# EAGLE design rekuperator THT (EAGLE 6.5.0)
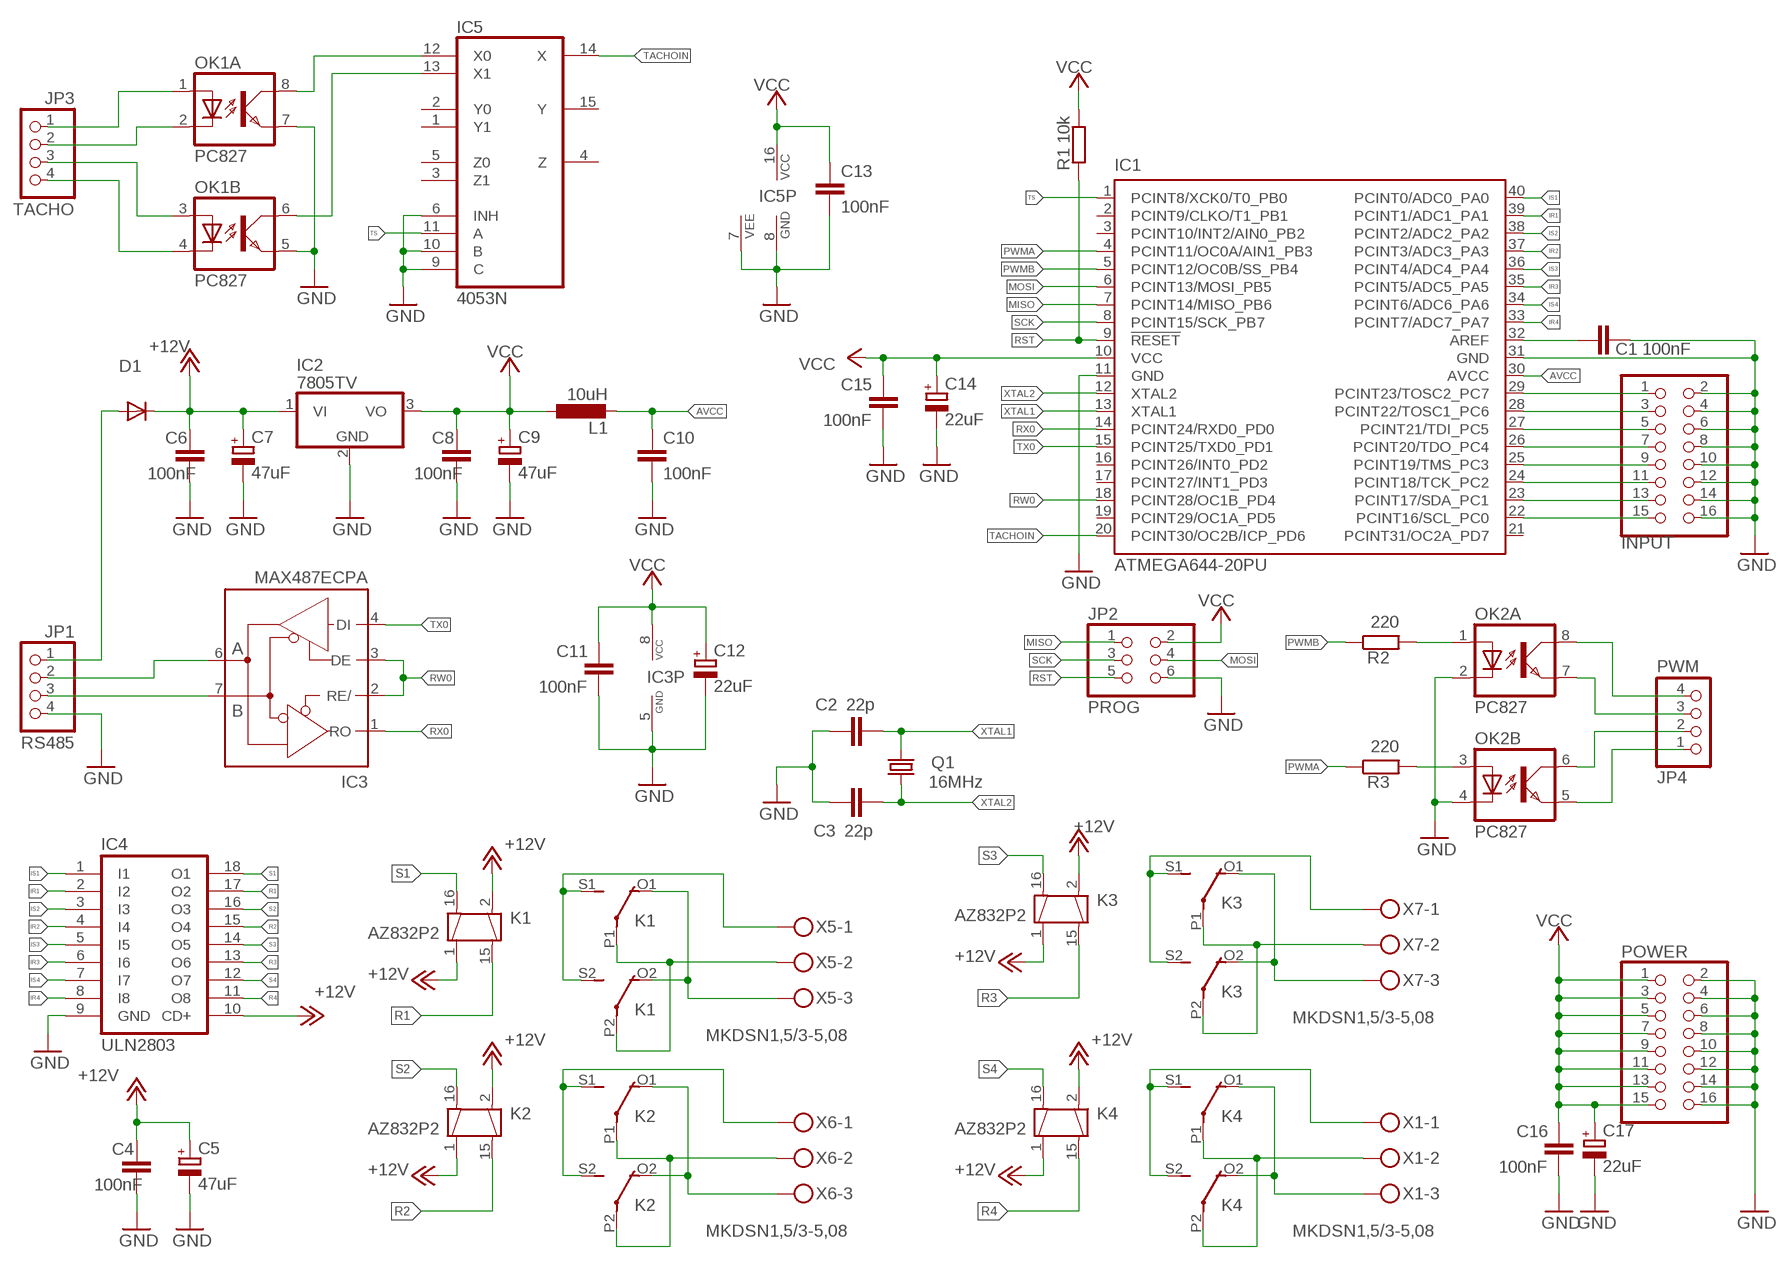
[diagram p0: schematic, sheet 1]

## Parts
C1  100nF  C-EU025-025X050  [C025-025X050]
C2  22p  C-EU025-024X044  [C025-024X044]
C3  22p  C-EU025-024X044  [C025-024X044]
C4  100nF  C-EU025-025X050  [C025-025X050]
C5  47uF  CPOL-EUE2.5-6  [E2,5-6]
C6  100nF  C-EU025-025X050  [C025-025X050]
C7  47uF  CPOL-EUE2.5-6  [E2,5-6]
C8  100nF  C-EU025-025X050  [C025-025X050]
C9  47uF  CPOL-EUE2.5-6  [E2,5-6]
C10  100nF  C-EU025-025X050  [C025-025X050]
C11  100nF  C-EU025-025X050  [C025-025X050]
C12  22uF  CPOL-EUE2-5  [E2-5]
C13  100nF  C-EU025-025X050  [C025-025X050]
C14  22uF  CPOL-EUE2-5  [E2-5]
C15  100nF  C-EU025-025X050  [C025-025X050]
C16  100nF  C-EU025-025X050  [C025-025X050]
C17  22uF  CPOL-EUE2-5  [E2-5]
D1  1N4002  BAS15  [DO34-7]
IC1  ATMEGA644-20PU  [DIL40]
IC2  7805TV  [TO220V]
IC3  MAX487ECPA  MAX481CPA  [DIL08]
IC4  ULN2803  ULN2803A  [DIL18]
IC5  4053N  [DIL16]
INPUT  PINHD-2X8  [2X08]
JP1  RS485  PINHD-1X4  [1X04]
JP2  PROG  PINHD-2X3  [2X03]
JP3  TACHO  PINHD-1X4  [1X04]
JP4  PWM  PINHD-1X4  [1X04]
K1  AZ832P2  DS2-L2-24V  [DS2E-L2]
K2  AZ832P2  DS2-L2-24V  [DS2E-L2]
K3  AZ832P2  DS2-L2-24V  [DS2E-L2]
K4  AZ832P2  DS2-L2-24V  [DS2E-L2]
L1  10uH  L-EU0207/12  [0207/12]
OK1  PC827  [DIL08]
OK2  PC827  [DIL08]
POWER  PINHD-2X8  [2X08]
Q1  16MHz  CRYSTALHC49S  [HC49/S]
R1  10k  R-EU_0204/2V  [0204V]
R2  220  R-EU_0207/12  [0207/12]
R3  220  R-EU_0207/12  [0207/12]
X1  MKDSN1,5/3-5,08  [MKDSN1,5/3-5,08]
X5  MKDSN1,5/3-5,08  [MKDSN1,5/3-5,08]
X6  MKDSN1,5/3-5,08  [MKDSN1,5/3-5,08]
X7  MKDSN1,5/3-5,08  [MKDSN1,5/3-5,08]

## Nets
+12V: C4.1 C5.+ C6.1 C7.+ D1.C IC2.1(VI) IC4.10(CD+) K1.1 K1.2 K2.1 K2.2 K3.1 K3.2 K4.1 K4.2
AVCC: C10.1 IC1.30(AVCC) L1.2
GND: C1.2 C2.1 C3.1 C4.2 C5.- C6.2 C7.- C8.2 C9.- C10.2 C11.2 C12.- C13.2 C14.- C15.2 C16.2 C17.- IC1.11(GND) IC1.31(GND) IC2.2(GND) IC3.5(GND) IC4.9(GND) IC5.6(INH) IC5.7(VEE) IC5.8(GND) IC5.9(C) IC5.10(B) INPUT.2 INPUT.4 INPUT.6 INPUT.8 INPUT.10 INPUT.12 INPUT.14 INPUT.16 JP1.4 JP2.6 OK1.5(B:EMIT) OK1.7(A:EMIT) OK2.2(A:C) OK2.4(B:C) POWER.2 POWER.4 POWER.6 POWER.8 POWER.10 POWER.12 POWER.14 POWER.16
IR1: IC1.39(PCINT1/ADC1_PA1) IC4.2(I2)
IR2: IC1.37(PCINT3/ADC3_PA3) IC4.4(I4)
IR3: IC1.35(PCINT5/ADC5_PA5) IC4.6(I6)
IR4: IC1.33(PCINT7/ADC7_PA7) IC4.8(I8)
IS1: IC1.40(PCINT0/ADC0_PA0) IC4.1(I1)
IS2: IC1.38(PCINT2/ADC2_PA2) IC4.3(I3)
IS3: IC1.36(PCINT4/ADC4_PA4) IC4.5(I5)
IS4: IC1.34(PCINT6/ADC6_PA6) IC4.7(I7)
MISO: IC1.7(PCINT14/MISO_PB6) JP2.1
MOSI: IC1.6(PCINT13/MOSI_PB5) JP2.4
N$1: K4.S1(2:S) K4.S2(3:S) X1.1
N$2: K4.P1(2:P) K4.P2(3:P) X1.2
N$3: D1.A JP1.1
N$4: IC3.7(B) JP1.3
N$5: IC3.6(A) JP1.2
N$6: K4.O1(2:O) K4.O2(3:O) X1.3
N$7: C1.1 IC1.32(AREF)
N$8: IC5.12(X0) OK1.8(A:COL)
N$9: K1.S1(2:S) K1.S2(3:S) X5.1
N$10: K2.S1(2:S) K2.S2(3:S) X6.1
N$11: K3.S1(2:S) K3.S2(3:S) X7.1
N$12: IC5.13(X1) OK1.6(B:COL)
N$13: K3.P1(2:P) K3.P2(3:P) X7.2
N$14: K2.P1(2:P) K2.P2(3:P) X6.2
N$15: K1.O1(2:O) K1.O2(3:O) X5.3
N$16: K2.O1(2:O) K2.O2(3:O) X6.3
N$17: JP3.2 OK1.2(A:C)
N$18: K1.P1(2:P) K1.P2(3:P) X5.2
N$19: K3.O1(2:O) K3.O2(3:O) X7.3
N$21: JP3.1 OK1.1(A:A)
N$22: JP3.3 OK1.3(B:A)
N$23: JP3.4 OK1.4(B:C)
N$24: JP4.3 OK2.7(A:EMIT)
N$25: JP4.2 OK2.6(B:COL)
N$26: OK2.1(A:A) R2.2
N$27: OK2.3(B:A) R3.2
N$28: JP4.4 OK2.8(A:COL)
N$29: JP4.1 OK2.5(B:EMIT)
N$31: IC1.29(PCINT23/TOSC2_PC7) INPUT.1
N$32: IC1.28(PCINT22/TOSC1_PC6) INPUT.3
N$33: IC1.27(PCINT21/TDI_PC5) INPUT.5
N$34: IC1.26(PCINT20/TDO_PC4) INPUT.7
N$35: IC1.25(PCINT19/TMS_PC3) INPUT.9
N$36: IC1.24(PCINT18/TCK_PC2) INPUT.11
N$37: IC1.23(PCINT17/SDA_PC1) INPUT.13
N$38: IC1.22(PCINT16/SCL_PC0) INPUT.15
PWMA: IC1.4(PCINT11/OC0A/AIN1_PB3) R3.1
PWMB: IC1.5(PCINT12/OC0B/SS_PB4) R2.1
R1: IC4.17(O2) K1.15
R2: IC4.15(O4) K2.15
R3: IC4.13(O6) K3.15
R4: IC4.11(O8) K4.15
RST: IC1.9(!RESET) JP2.5 R1.2
RW0: IC1.18(PCINT28/OC1B_PD4) IC3.2(RE/) IC3.3(DE)
RX0: IC1.14(PCINT24/RXD0_PD0) IC3.1(RO)
S1: IC4.18(O1) K1.16
S2: IC4.16(O3) K2.16
S3: IC4.14(O5) K3.16
S4: IC4.12(O7) K4.16
SCK: IC1.8(PCINT15/SCK_PB7) JP2.3
TACHOIN: IC1.20(PCINT30/OC2B/ICP_PD6) IC5.14(X)
TS: IC1.1(PCINT8/XCK0/T0_PB0) IC5.11(A)
TX0: IC1.15(PCINT25/TXD0_PD1) IC3.4(DI)
VCC: C8.1 C9.+ C11.1 C12.+ C13.1 C14.+ C15.1 C16.1 C17.+ IC1.10(VCC) IC2.3(VO) IC3.8(VCC) IC5.16(VCC) JP2.2 L1.1 POWER.1 POWER.3 POWER.5 POWER.7 POWER.9 POWER.11 POWER.13 POWER.15 R1.1
XTAL1: C2.2 IC1.13(XTAL1) Q1.2
XTAL2: C3.2 IC1.12(XTAL2) Q1.1
Unconnected: IC1.2(PCINT9/CLKO/T1_PB1) IC1.3(PCINT10/INT2/AIN0_PB2) IC1.16(PCINT26/INT0_PD2) IC1.17(PCINT27/INT1_PD3) IC1.19(PCINT29/OC1A_PD5) IC1.21(PCINT31/OC2A_PD7) IC5.1(Y1) IC5.2(Y0) IC5.3(Z1) IC5.4(Z) IC5.5(Z0) IC5.15(Y)

## Library data of the parts
C1-C4 C6 C8 C10 C11 C13 C15 C16 = rcl:C-EU: CAPACITOR, European symbol
C5 C7 C9 C12 C14 C17 = rcl:CPOL-EU: POLARIZED CAPACITOR, European symbol
D1 = diode:BAS15: DIODE high speed
IC1 = atmel:ATMEGA644-*PU: 8-bit Microcontroller with 64K Bytes In-System Programmable Flash Auto generated by make-symbol-device-package-bsdl.ulp Rev. 34 Source: http://www.atmel.com/dyn/resources/prod_documents/doc2593.pdf; MPN: ATMEGA644-20PU; OC_FARNELL: 1288340; OC_NEWARK: 23M5060
IC2 = linear:78*: Positive VOLTAGE REGULATOR Source: http://cache.national.com/ds/LM/LM78L05.pdf http://www.fairchildsemi.com/ds/LM/LM7805.pdf
IC3 = maxim:MAX481CPA: RS485 TRANSEIVER; MPN: MAX481CPA+; OC_FARNELL: unknown; OC_NEWARK: 99K3445
IC4 = uln-udn:ULN2803A: DRIVER ARRAY
IC5 = 40xx:4053: Triple 2-channel ANALOG MULTIPLEXER
INPUT POWER = pinhead:PINHD-2X8: PIN HEADER
JP1 JP3 JP4 = pinhead:PINHD-1X4: PIN HEADER
JP2 = pinhead:PINHD-2X3: PIN HEADER
K1-K4 = relay:DS2-L2-*: RELAY NAiS bistable, 2 x switch, 4 A/250 V; OC_FARNELL: unknown; OC_NEWARK: unknown
L1 = rcl:L-EU: INDUCTOR, European symbol
OK1 OK2 = optocoupler:PC827: SHARP OPTO COUPLER; OC_FARNELL: unknown; OC_NEWARK: unknown
Q1 = crystal:CRYSTAL: CRYSTAL; OC_FARNELL: 1667008; OC_NEWARK: unknown
R1-R3 = rcl:R-EU_: RESISTOR, European symbol
X1 X5-X7 = con-phoenix-508:MKDSN1,5/3-5,08: MKDSN 1,5/ 3-5,08 Printklemme Nennstrom: 13,5 A Nennspannung: 250 V Rastermaß: 5,08 mm Polzahl: 3 Anschlussart: Schraubanschluss Montage: Löten Anschlussrichtung Leiter/Platine: 0 ° Artikelnummer: 1729131 Source: http://eshop.phoenixcontact.com .. 1729131.pdf; MPN: SMKDSN1,5/3-5,08; OC_FARNELL: 1792904; OC_NEWARK: 70R0299

## Board
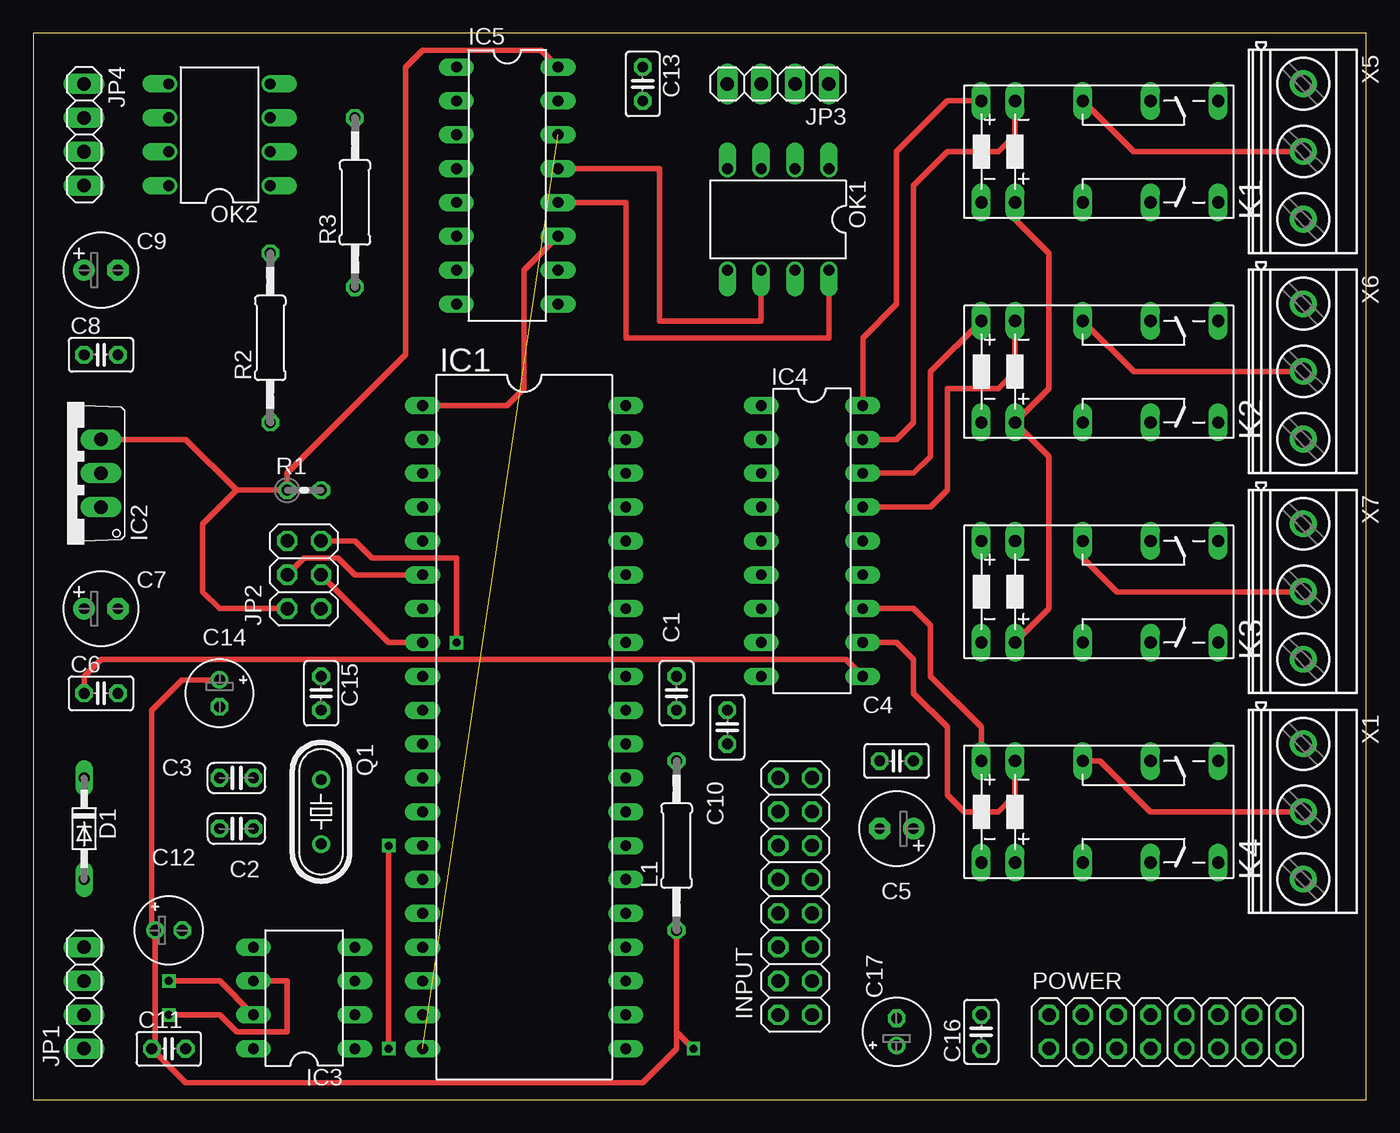
[diagram p1: board, top side]
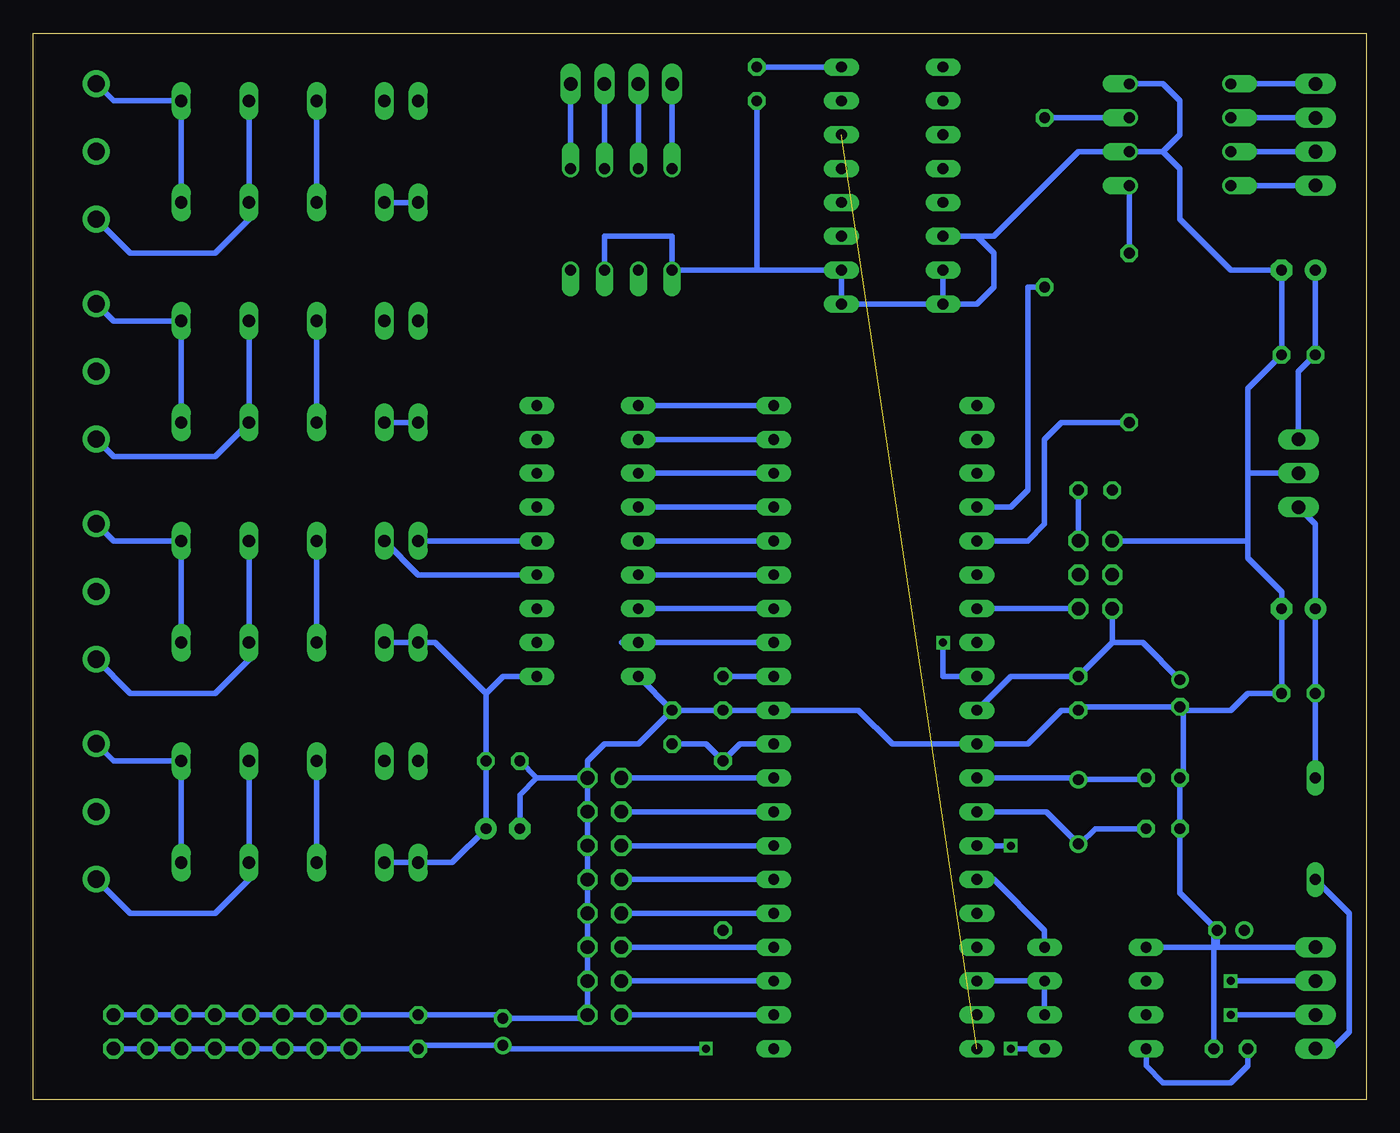
[diagram p2: board, bottom side, seen from below]

Size 100 x 80 mm. Coordinates in mm from the lower left corner, seen from the top.
Outline: 0,0 100,0 100,80 0,80 0,0
Copper layers (1*16): Top 0.035mm / dielectric 1.5mm / Bottom 0.035mm
Design rules "default": minimum track width 10mil, minimum drill 24mil, track to track 8mil, track to pad 8mil, pad to pad 8mil, via to via 8mil, smd to smd 8mil, copper to edge 40mil, drill to drill 8mil, minimum pad ring 10mil, minimum via ring 8mil, stop-mask expansion 4mil, vias tented up to drill 0mil, thermal gap 10mil

### Footprints (pad centres in the part's own frame; a part is rotated, then mirrored left to right if it is on the bottom)
C025-025X050 = drill 0.813 octagon: 1 -1.27,0; 2 1.27,0
C025-024X044 = drill 0.813 octagon: 1 -1.27,0; 2 1.27,0
E2,5-6 = drill 0.813 pad 1.6: + -1.27,0 | drill 0.813 pad 1.6 octagon: - 1.27,0
E2-5 = drill 0.813 pad 1.27: + -1.016,0 | drill 0.813 pad 1.27 octagon: - 1.016,0
DO34-7 = drill 0.813 long: A 3.81,0; C -3.81,0
DIL40 = drill 0.813 long: 1 -24.13,-7.62; 2 -21.59,-7.62; 3 -19.05,-7.62; 4 -16.51,-7.62; 5 -13.97,-7.62; 6 -11.43,-7.62; 7 -8.89,-7.62; 8 -6.35,-7.62; 9 -3.81,-7.62; 10 -1.27,-7.62; 11 1.27,-7.62; 12 3.81,-7.62; 13 6.35,-7.62; 14 8.89,-7.62; 15 11.43,-7.62; 16 13.97,-7.62; 17 16.51,-7.62; 18 19.05,-7.62; 19 21.59,-7.62; 20 24.13,-7.62; 21 24.13,7.62; 22 21.59,7.62; 23 19.05,7.62; 24 16.51,7.62; 25 13.97,7.62; 26 11.43,7.62; 27 8.89,7.62; 28 6.35,7.62; 29 3.81,7.62; 30 1.27,7.62; 31 -1.27,7.62; 32 -3.81,7.62; 33 -6.35,7.62; 34 -8.89,7.62; 35 -11.43,7.62; 36 -13.97,7.62; 37 -16.51,7.62; 38 -19.05,7.62; 39 -21.59,7.62; 40 -24.13,7.62
TO220V = drill 1.016 long: 1 -2.54,-2.54; 2 0,-2.54; 3 2.54,-2.54
DIL08 = drill 0.813 long: 1 -3.81,-3.81; 2 -1.27,-3.81; 3 1.27,-3.81; 4 3.81,-3.81; 5 3.81,3.81; 6 1.27,3.81; 7 -1.27,3.81; 8 -3.81,3.81
DIL18 = drill 0.813 long: 1 -10.16,-3.81; 2 -7.62,-3.81; 3 -5.08,-3.81; 4 -2.54,-3.81; 5 0,-3.81; 6 2.54,-3.81; 7 5.08,-3.81; 8 7.62,-3.81; 9 10.16,-3.81; 10 10.16,3.81; 11 7.62,3.81; 12 5.08,3.81; 13 2.54,3.81; 14 0,3.81; 15 -2.54,3.81; 16 -5.08,3.81; 17 -7.62,3.81; 18 -10.16,3.81
DIL16 = drill 0.813 long: 1 -8.89,-3.81; 2 -6.35,-3.81; 3 -3.81,-3.81; 4 -1.27,-3.81; 5 1.27,-3.81; 6 3.81,-3.81; 7 6.35,-3.81; 8 8.89,-3.81; 9 8.89,3.81; 10 6.35,3.81; 11 3.81,3.81; 12 1.27,3.81; 13 -1.27,3.81; 14 -3.81,3.81; 15 -6.35,3.81; 16 -8.89,3.81
2X08 = drill 1.016 octagon: 1 -8.89,-1.27; 2 -8.89,1.27; 3 -6.35,-1.27; 4 -6.35,1.27; 5 -3.81,-1.27; 6 -3.81,1.27; 7 -1.27,-1.27; 8 -1.27,1.27; 9 1.27,-1.27; 10 1.27,1.27; 11 3.81,-1.27; 12 3.81,1.27; 13 6.35,-1.27; 14 6.35,1.27; 15 8.89,-1.27; 16 8.89,1.27
1X04 = drill 1.016 long: 1 -3.81,0; 2 -1.27,0; 3 1.27,0; 4 3.81,0
2X03 = drill 1.016 octagon: 1 -2.54,-1.27; 2 -2.54,1.27; 3 0,-1.27; 4 0,1.27; 5 2.54,-1.27; 6 2.54,1.27
DS2E-L2 = drill 0.914 long: 1 -7.62,-3.81; 2 -5.08,-3.81; 15 -5.08,3.81; 16 -7.62,3.81; O1 5.08,-3.81; O2 5.08,3.81; P1 0,-3.81; P2 0,3.81; S1 10.16,-3.81; S2 10.16,3.81
0207/12 = drill 0.813 octagon: 1 -6.35,0; 2 6.35,0
DIL08' = drill 0.813 offset: 1 -3.81,-3.81; 2 -1.27,-3.81; 3 1.27,-3.81; 4 3.81,-3.81; 5 3.81,3.81; 6 1.27,3.81; 7 -1.27,3.81; 8 -3.81,3.81
HC49/S = drill 0.813: 1 -2.413,0; 2 2.413,0
0204V = drill 0.813 octagon: 1 -1.27,0; 2 1.27,0
MKDSN1,5/3-5,08 = drill 1.3 pad 2: 1 -7.641,0.025; 2 -2.561,0.025; 3 2.519,0.025

### Placement (x,y rotation side)
C1  48.26,30.48 270 top
C2  15.24,20.32 0 top
C3  15.24,24.13 0 top
C4  64.77,25.4 180 top
C5  64.77,20.32 180 top
C6  5.08,30.48 0 top
C7  5.08,36.83 0 top
C8  5.08,55.88 0 top
C9  5.08,62.23 0 top
C10  52.07,27.94 90 top
C11  10.16,3.81 0 top
C12  10.16,12.7 0 top
C13  45.72,76.2 270 top
C14  13.97,30.48 270 top
C15  21.59,30.48 270 top
C16  71.12,5.08 90 top
C17  64.77,5.08 90 top
D1  3.81,20.32 270 top
IC1  36.83,27.94 270 top
IC2  2.54,46.99 90 top
IC3  20.32,7.62 90 top
IC4  58.42,41.91 270 top
IC5  35.56,68.58 270 top
INPUT  57.15,15.24 270 top
JP1  3.81,7.62 90 top
JP2  20.32,39.37 90 top
JP3  55.88,76.2 180 top
JP4  3.81,72.39 270 top
K1  78.74,71.12 0 top
K2  78.74,54.61 0 top
K3  78.74,38.1 0 top
K4  78.74,21.59 0 top
L1  48.26,19.05 90 top
OK1  PC827  [DIL08']  55.88,66.04 180 top
OK2  PC827  [DIL08']  13.97,72.39 90 top
POWER  85.09,5.08 0 top
Q1  21.59,21.59 270 top
R1  20.32,45.72 0 top
R2  17.78,57.15 90 top
R3  24.13,67.31 90 top
X1  95.25,19.05 270 top
X5  95.25,68.58 270 top
X6  95.25,52.07 270 top
X7  95.25,35.56 270 top

### Tracks (layer width: path | path; a pad name or v marks a point on that pad's centre or on a via)
+12V
  Top 0.406: C6.1 3.81,31.75 5.08,33.02 60.96,33.02 IC4.10 | K1.2 73.66,66.04 76.2,63.5 76.2,53.34 K2.2 76.2,48.26 76.2,36.83 K3.2
  Bottom 0.406: D1.C C6.1 C7.+ 3.81,43.18 IC2.1 | K4.2 K4.1 68.58,17.78 C5.+ C4.1 66.04,30.48 | 66.04,30.48 64.77,31.75 IC4.10 | K3.2 K3.1 69.85,34.29 66.04,30.48 | K1.1 K1.2 | K2.1 K2.2
AVCC
  Bottom 0.406: IC1.30 46.99,26.67 L1.2 49.53,26.67 C10.1
GND
  Bottom 0.406: 15.24,71.12 13.97,69.85 13.97,66.04 10.16,62.23 C9.- C8.2 8.89,53.34 8.89,46.99 | 15.24,71.12 OK2.2 21.59,71.12 27.94,64.77 IC5.6 29.21,64.77 27.94,63.5 27.94,60.96 29.21,59.69 IC5.8 | 15.24,71.12 13.97,72.39 13.97,74.93 15.24,76.2 OK2.4 | POWER.12 POWER.14 POWER.16 POWER.10 POWER.8 POWER.6 POWER.4 POWER.2 C16.2 65.02,6.35 C17.- 58.67,6.1 INPUT.16 INPUT.14 INPUT.12 INPUT.10 INPUT.8 INPUT.6 INPUT.4 INPUT.2 | INPUT.2 62.23,24.13 | 62.23,24.13 C4.2 | C5.- 63.5,22.86 62.23,24.13 | C10.2 IC4.9 | C10.2 54.61,26.67 57.15,26.67 58.42,25.4 INPUT.2 | C10.2 C1.2 IC1.31 38.1,29.21 35.56,26.67 IC1.11 25.4,26.67 22.86,29.21 C15.2 21.34,29.46 C14.- 13.72,29.21 | 8.89,41.91 8.89,40.64 6.35,38.1 C7.- C6.2 8.89,30.48 10.16,29.21 13.72,29.21 | 8.89,41.91 8.89,46.99 | IC2.2 8.89,46.99 | IC5.7 IC5.8 | IC5.8 IC5.9 IC5.10 45.72,62.23 | 45.72,62.23 OK1.5 52.07,64.77 57.15,64.77 OK1.7 | C13.2 45.72,62.23 | JP2.6 8.89,41.91 | JP1.4 11.43,11.43 | 11.43,11.43 IC3.5 | 13.72,29.21 13.72,24.38 C3.1 C2.1 13.97,15.49 C12.- | C12.- 11.18,11.68 11.43,11.43 | C11.2 11.43,12.45 C12.-
IR1
  Bottom 0.406: IC1.39 IC4.2
IR2
  Bottom 0.406: IC1.37 IC4.4
IR3
  Bottom 0.406: IC1.35 IC4.6
IR4
  Bottom 0.406: IC1.33 IC4.8 55.88,34.29
IS1
  Bottom 0.406: IC1.40 IC4.1
IS2
  Bottom 0.406: IC1.38 IC4.3
IS3
  Bottom 0.406: IC1.36 IC4.5
IS4
  Bottom 0.406: IC1.34 IC4.7
MISO
  Bottom 0.406: JP2.1 IC1.7
MOSI
  Top 0.406: JP2.4 20.32,40.64 22.86,40.64 24.13,39.37 IC1.6
N$1
  Bottom 0.406: K4.S1 K4.S2 93.98,25.4 X1.1
N$2
  Top 0.406: K4.P2 80.01,25.4 83.82,21.59 95.25,21.59 X1.2
  Bottom 0.406: K4.P2 K4.P1
N$3
  Bottom 0.406: JP1.1 2.54,3.81 1.27,5.08 1.27,13.97 D1.A
N$4  (via drill 0.6)
  Top 0.406: v10.16,8.89 13.97,8.89 IC3.7
  Bottom 0.406: JP1.3 v10.16,8.89
N$5  (via drill 0.6)
  Top 0.406: v10.16,6.35 13.97,6.35 15.24,5.08 19.05,5.08 19.05,8.89 IC3.6
  Bottom 0.406: JP1.2 v10.16,6.35
N$6
  Bottom 0.406: K4.O2 K4.O1 83.82,16.51 86.36,13.97 92.71,13.97 X1.3
N$7
  Bottom 0.406: IC1.32 C1.1
N$8
  Top 0.406: IC5.12 44.45,67.31 44.45,57.15 59.69,57.15 OK1.8
N$9
  Bottom 0.406: K1.S1 K1.S2 93.98,74.93 X5.1
N$10
  Bottom 0.406: K2.S1 K2.S2 93.98,58.42 95.25,59.69 X6.1
N$11
  Bottom 0.406: K3.S1 K3.S2 93.98,41.91 X7.1
N$12
  Top 0.406: IC5.13 46.99,69.85 46.99,58.42 54.61,58.42 OK1.6
N$13
  Top 0.406: K3.P2 78.74,40.64 81.28,38.1 95.25,38.1 X7.2
  Bottom 0.406: K3.P2 K3.P1
N$14
  Top 0.406: K2.P2 82.55,54.61 95.25,54.61 X6.2
  Bottom 0.406: K2.P2 K2.P1
N$15
  Bottom 0.406: K1.O2 K1.O1 83.82,66.04 86.36,63.5 92.71,63.5 X5.3
N$16
  Bottom 0.406: K2.O2 K2.O1 86.36,48.26 93.98,48.26 X6.3
N$17
  Bottom 0.406: JP3.2 OK1.2
N$18
  Top 0.406: K1.P2 82.55,71.12 95.25,71.12 X5.2
  Bottom 0.406: K1.P2 K1.P1
N$19
  Bottom 0.406: K3.O2 K3.O1 83.82,33.02 86.36,30.48 92.71,30.48 X7.3
N$21
  Bottom 0.406: JP3.1 OK1.1
N$22
  Bottom 0.406: JP3.3 OK1.3
N$23
  Bottom 0.406: JP3.4 OK1.4
N$24
  Bottom 0.406: JP4.3 OK2.7
N$25
  Bottom 0.406: JP4.2 OK2.6
N$26
  Bottom 0.406: OK2.1 R2.2
N$27
  Bottom 0.406: OK2.3 R3.2
N$28
  Bottom 0.406: JP4.4 OK2.8
N$29
  Bottom 0.406: JP4.1 OK2.5
N$31
  Bottom 0.406: IC1.29 INPUT.1
N$32
  Bottom 0.406: IC1.28 INPUT.3
N$33
  Bottom 0.406: IC1.27 INPUT.5
N$34
  Bottom 0.406: IC1.26 INPUT.7
N$35
  Bottom 0.406: IC1.25 INPUT.9
N$36
  Bottom 0.406: IC1.24 INPUT.11
N$37
  Bottom 0.406: IC1.23 INPUT.13
N$38
  Bottom 0.406: IC1.22 INPUT.15
PWMA
  Bottom 0.406: R3.1 25.4,60.96 25.4,45.72 26.67,44.45 IC1.4
PWMB
  Bottom 0.406: R2.1 22.86,50.8 24.13,49.53 24.13,43.18 25.4,41.91 IC1.5
R1
  Top 0.406: IC4.17 64.77,49.53 66.04,50.8 66.04,68.58 68.58,71.12 72.39,71.12 73.66,72.39 K1.15
R2
  Top 0.406: IC4.15 67.31,44.45 68.58,45.72 68.58,53.34 72.39,53.34 73.66,54.61 K2.15
R3
  Bottom 0.406: IC4.13 71.12,39.37 K3.15
R4
  Top 0.406: IC4.11 64.77,34.29 66.04,33.02 66.04,30.48 68.58,27.94 68.58,22.86 69.85,21.59 72.39,21.59 73.66,22.86 K4.15
RST  (via drill 0.6)
  Top 0.406: JP2.5 24.13,41.91 25.4,40.64 31.75,40.64 v31.75,34.29
  Bottom 0.406: R1.2 JP2.5 | v31.75,34.29 31.75,31.75 IC1.9
RW0
  Bottom 0.406: IC1.18 IC3.3 IC3.2
RX0  (via drill 0.6)
  Top 0.406: v26.67,19.05 v26.67,3.81
  Bottom 0.406: IC1.14 v26.67,19.05 | v26.67,3.81 IC3.1
S1
  Top 0.406: IC4.18 62.23,57.15 64.77,59.69 64.77,71.12 68.58,74.93 K1.16
S2
  Top 0.406: IC4.16 66.04,46.99 67.31,48.26 67.31,54.61 K2.16
S3
  Bottom 0.406: IC4.14 K3.16
S4
  Top 0.406: IC4.12 66.04,36.83 67.31,35.56 67.31,31.75 71.12,27.94 K4.16
SCK
  Top 0.406: JP2.3 26.67,34.29 IC1.8
TACHOIN  (1 unrouted)
TS
  Top 0.406: IC1.1 35.56,52.07 36.83,53.34 36.83,62.23 IC5.11
TX0
  Bottom 0.406: IC3.4 24.13,12.7 27.94,16.51 IC1.15
VCC  (via drill 0.6)
  Top 0.406: v49.53,3.81 48.26,5.08 L1.1 48.26,3.81 45.72,1.27 11.43,1.27 C11.1 9.14,4.06 C12.+ 8.89,12.95 8.89,29.21 11.18,31.5 C14.+ | IC2.3 11.43,49.53 15.24,45.72 | 15.24,45.72 R1.1 19.05,46.99 27.94,55.88 27.94,77.47 29.21,78.74 38.1,78.74 IC5.16 | 15.24,45.72 12.7,43.18 12.7,38.1 13.97,36.83 JP2.2
  Bottom 0.406: IC2.3 5.08,54.61 C8.1 C9.+ | IC5.16 C13.1 | v49.53,3.81 64.52,3.81 C17.+ 70.87,4.06 C16.1 POWER.1 POWER.3 POWER.5 POWER.7 POWER.9 POWER.11 POWER.13 POWER.15 | JP2.2 19.05,34.29 | 19.05,34.29 C15.1 26.67,31.75 IC1.10 | C11.1 8.89,2.54 10.16,1.27 15.24,1.27 16.51,2.54 IC3.8 | 19.05,34.29 16.76,34.29 C14.+
XTAL1
  Bottom 0.406: IC1.13 24,21.59 Q1.2 21.46,19.18 20.32,20.32 C2.2
XTAL2
  Bottom 0.406: IC1.12 21.72,24.13 Q1.1 16.64,24 C3.2